# EAGLE design TinyGame RC2 (EAGLE 7.7.0)
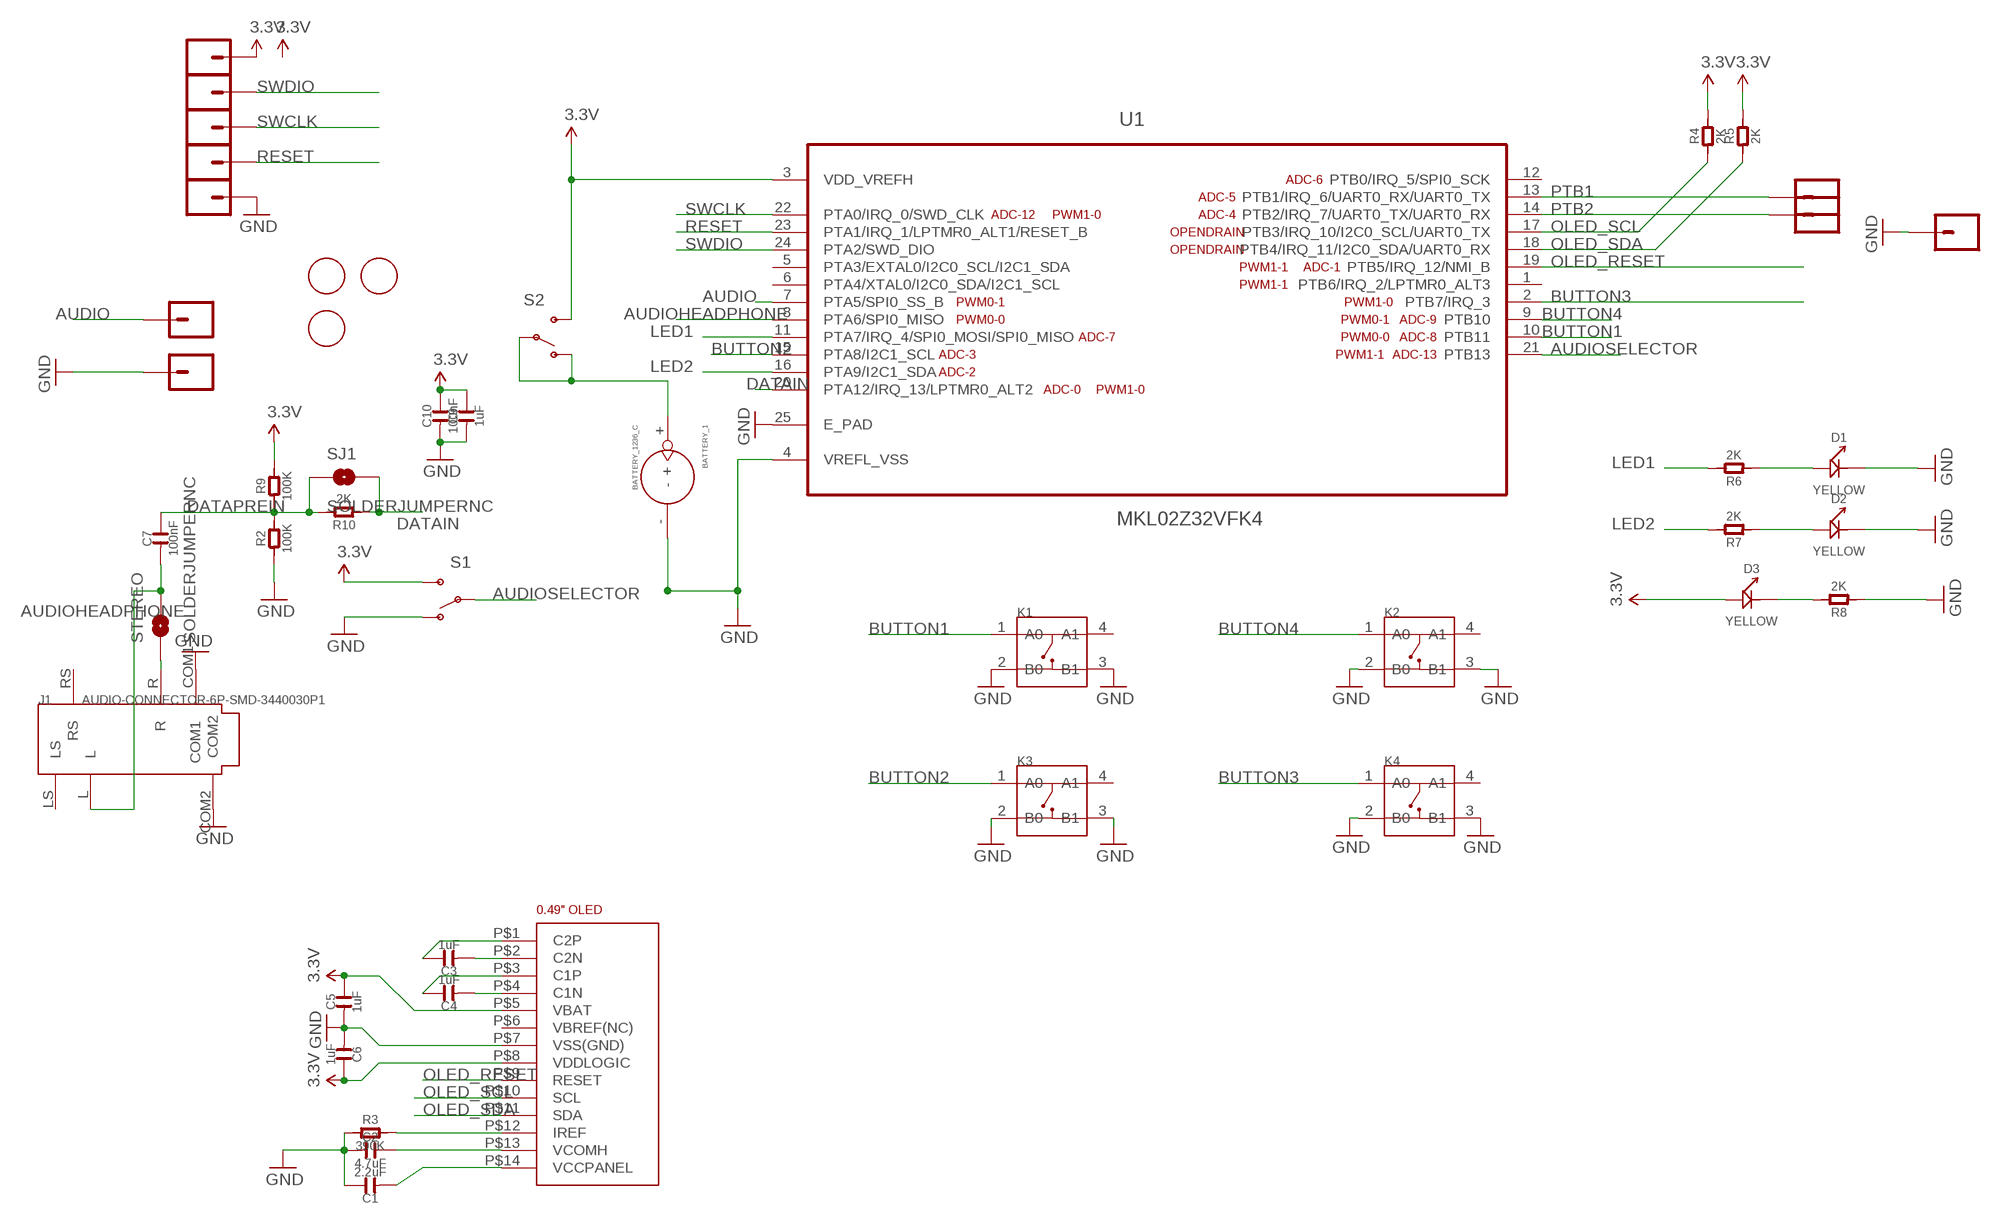
[diagram p0: schematic, sheet 1]

## Parts
AUDIOGND  M01SMD-4.5X1.5  [PAD-1.5X4.5]
AUDIOSIG  M01SMD-4.5X1.5  [PAD-1.5X4.5]
BATTERY_1  BATTERY_1236_C  [BATTERY_1236_C]
C1  2.2uF  C-0603  [C0603]
C2  4.7uF  C-0603  [C0603]
C3  1uF  C-0603  [C0603]
C4  1uF  C-0603  [C0603]
C5  1uF  C-0603  [C0603]
C6  1uF  C-0603  [C0603]
C7  100nF  C-0603  [C0603]
C9  1uF  C-0603  [C0603]
C10  100nF  C-0603  [C0603]
D1  YELLOW  LED  [LED0603]
D2  YELLOW  LED  [LED0603]
D3  YELLOW  LED  [LED0603]
J1  AUDIO-CONNECTOR-6P-SMD-3440030P1  [6P-SMD-3.5]
K1  BUTTON-4P-3100010P1  [4P-SMD-6.0X6.0X5.0H]
K2  BUTTON-4P-3100010P1  [4P-SMD-6.0X6.0X5.0H]
K3  BUTTON-4P-3100010P1  [4P-SMD-6.0X6.0X5.0H]
K4  BUTTON-4P-3100010P1  [4P-SMD-6.0X6.0X5.0H]
PTA6_MISO1  M01SMD-4.5X1.5  [PAD-1.5X4.5]
PTA6_MISO2  M01SMD-4.5X1.5  [PAD-1.5X4.5]
PTA6_MISO3  M01SMD-4.5X1.5  [PAD-1.5X4.5]
PTA6_MISO4  M01SMD-4.5X1.5  [PAD-1.5X4.5]
PTA6_MISO5  M01SMD-4.5X1.5  [PAD-1.5X4.5]
PTB1_RXTX  M01SMD-4.5X1.5  [PAD-1.5X4.5]
PTB2_TXRX  M01SMD-4.5X1.5  [PAD-1.5X4.5]
PTB2_TXRX2  M01SMD-4.5X1.5  [PAD-1.5X4.5]
R2  100K  R-0603  [R0603]
R3  390K  R-0603  [R0603]
R4  2K  R-0603  [R0603]
R5  2K  R-0603  [R0603]
R6  2K  R-0603  [R0603]
R7  2K  R-0603  [R0603]
R8  2K  R-0603  [R0603]
R9  100K  R-0603  [R0603]
R10  2K  R-0603  [R0603]
S1  SWITCH-SPDT-SMD-A  [SWITCH-SPST-SMD-A]
S2  SWITCH-SPDT-SMD-A  [SWITCH-SPST-SMD-A]
SJ1  SOLDERJUMPERNC  [SJ_2S]
STEREO  SOLDERJUMPERNC  [SJ_2S]
U1  MKL02Z32VFK4  [QFN50P400X400X100-25N]
U$1  0.49"OLEDFOLDED  [0.49"-FPC-0.7-14-FOLDED]
U$2  FIDUCIAL  [FIDUCIAL_1MM]
U$3  FIDUCIAL  [FIDUCIAL_1MM]
U$4  FIDUCIAL  [FIDUCIAL_1MM]

## Nets
3.3V: C5.2 C6.2 C9.2 C10.2 D3.+ PTA6_MISO1.P$1 R4.2 R5.2 R9.2 S1.3(S) S2.3(S) U1.3(VDD_VREFH) U$1.P$5(VBAT) U$1.P$8(VDDLOGIC)
AUDIO: AUDIOSIG.P$1 U1.7(PTA5/SPI0_SS_B)
AUDIOHEADPHONE: C7.1 J1.L STEREO.2 U1.8(PTA6/SPI0_MISO)
AUDIOSELECTOR: S1.2(P) U1.21(PTB13)
BUTTON1: K1.1(A0) U1.10(PTB11)
BUTTON2: K3.1(A0) U1.15(PTA8/I2C1_SCL)
BUTTON3: K4.1(A0) U1.2(PTB7/IRQ_3)
BUTTON4: K2.1(A0) U1.9(PTB10)
DATAIN: R10.1 SJ1.2 U1.20(PTA12/IRQ_13/LPTMR0_ALT2)
DATAPREIN: C7.2 R2.2 R9.1 R10.2 SJ1.1
GND [GND]: AUDIOGND.P$1 BATTERY_1.- C1.2 C2.1 C5.1 C6.1 C9.1 C10.1 D1.- D2.- J1.COM1 J1.COM2 K1.2(B0) K1.3(B1) K2.2(B0) K2.3(B1) K3.2(B0) K3.3(B1) K4.2(B0) K4.3(B1) PTA6_MISO5.P$1 PTB2_TXRX2.P$1 R2.1 R3.1 R8.1 S1.1(O) U1.4(VREFL_VSS) U1.25(E_PAD) U$1.P$7(VSS(GND))
LED1: R6.2 U1.11(PTA7/IRQ_4/SPI0_MOSI/SPI0_MISO)
LED2: R7.2 U1.16(PTA9/I2C1_SDA)
N$1: J1.R STEREO.1
N$3: C3.2 U$1.P$1(C2P)
N$4: C4.2 U$1.P$3(C1P)
N$6: D1.+ R6.1
N$9: R3.2 U$1.P$12(IREF)
N$10: C1.1 U$1.P$14(VCCPANEL)
N$11: C2.2 U$1.P$13(VCOMH)
N$12: C3.1 U$1.P$2(C2N)
N$13: C4.1 U$1.P$4(C1N)
N$14: D2.+ R7.1
N$19: D3.- R8.2
OLED_RESET: U1.19(PTB5/IRQ_12/NMI_B) U$1.P$9(RESET)
OLED_SCL: R4.1 U1.17(PTB3/IRQ_10/I2C0_SCL/UART0_TX) U$1.P$10(SCL)
OLED_SDA: R5.1 U1.18(PTB4/IRQ_11/I2C0_SDA/UART0_RX) U$1.P$11(SDA)
PTB1: PTB1_RXTX.P$1 U1.13(PTB1/IRQ_6/UART0_RX/UART0_TX)
PTB2: PTB2_TXRX.P$1 U1.14(PTB2/IRQ_7/UART0_TX/UART0_RX)
RESET: PTA6_MISO4.P$1 U1.23(PTA1/IRQ_1/LPTMR0_ALT1/RESET_B)
SWCLK: PTA6_MISO3.P$1 U1.22(PTA0/IRQ_0/SWD_CLK)
SWDIO: PTA6_MISO2.P$1 U1.24(PTA2/SWD_DIO)
VBAT: BATTERY_1.+ S2.1(O) S2.2(P)
Unconnected: J1.LS J1.RS K1.4(A1) K2.4(A1) K3.4(A1) K4.4(A1) U1.1(PTB6/IRQ_2/LPTMR0_ALT3) U1.5(PTA3/EXTAL0/I2C0_SCL/I2C1_SDA) U1.6(PTA4/XTAL0/I2C0_SDA/I2C1_SCL) U1.12(PTB0/IRQ_5/SPI0_SCK) U$1.P$6(VBREF(NC))

## Library data of the parts
AUDIOGND AUDIOSIG PTA6_MISO1-PTA6_MISO5 PTB1_RXTX PTB2_TXRX PTB2_TXRX2 = SparkFun-Connectors:M01: Header 1 Standard 1-pin 0.1" header. Use with straight break away headers (SKU : PRT-00116), right angle break away headers (PRT-00553), swiss pins (PRT-00743), machine pins (PRT-00117), and female headers (PRT-00115).
BATTERY_1 = MicroGameboyParts:BATTERY_1236_C: SOC004
C1-C7 C9 C10 = OPL:C*
D1-D3 = OPL:LED*: LED
J1 = OPL:AUDIO-CONNECTOR-6P-SMD
K1-K4 = zephod-components:BUTTON-4P
R2-R10 = OPL:R*
S1 S2 = SparkFun-Electromechanical:SWITCH-SPDT: SPDT Switch Simple slide switch, Spark Fun Electronics SKU : COM-00102 DPDT SMT slide switch, AYZ0202, SWCH-08179
SJ1 STEREO = SparkFun-Passives:SOLDERJUMPER: Solder Jumper Standard SMD solder jumper. Used to automate production. Two varients : Normally Open and Normally Closed are the same, but have different paste layers. NC will have a large amount of paste and should jumper during reflow.
U1 = FarnellThings:MKL02Z32VFK4: IC, MCU, 32BIT, CORTEX M0+, 48MHZ, QFN-24; MPN: MKL02Z32VFK4; OC_FARNELL: 2321481; OC_NEWARK: 61W9887; PACKAGE: QFN-24; SUPPLIER: FREESCALE SEMICONDUCTOR
U$1 = zephod-tft:0.49"OLED
U$2-U$4 = adafruit:FIDUCIAL: For use by pick and place machines to calibrate the vision/machine, 1mm By microbuilder.eu

## Net classes
0 default: clearance 0.178 mm
1 GND: width 0.203 mm, drill 0.203 mm, clearance 0.203 mm

## Board
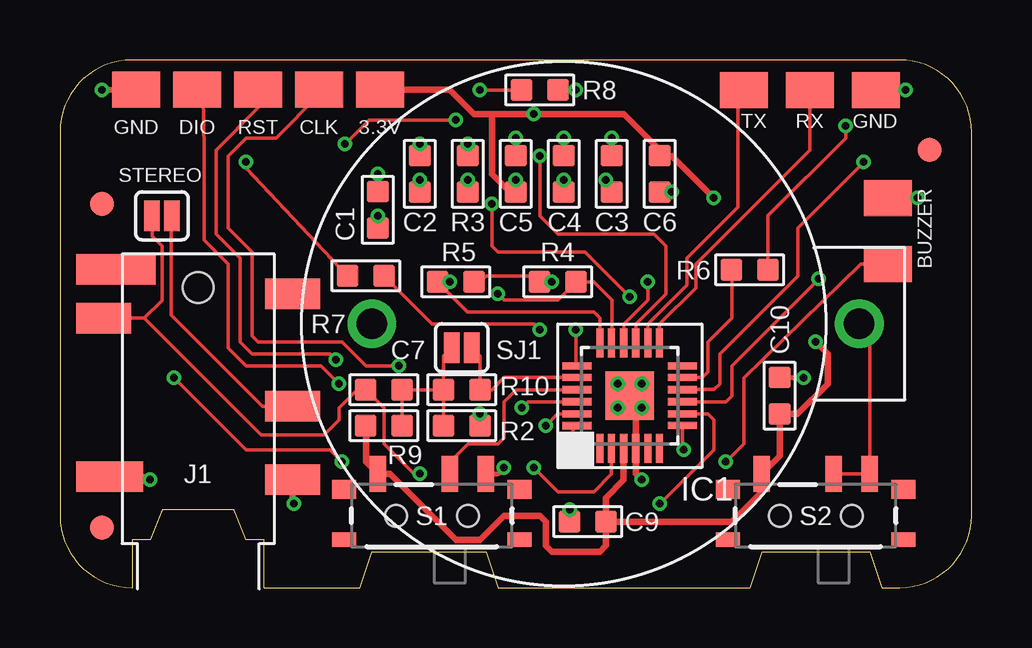
[diagram p1: board, top side]
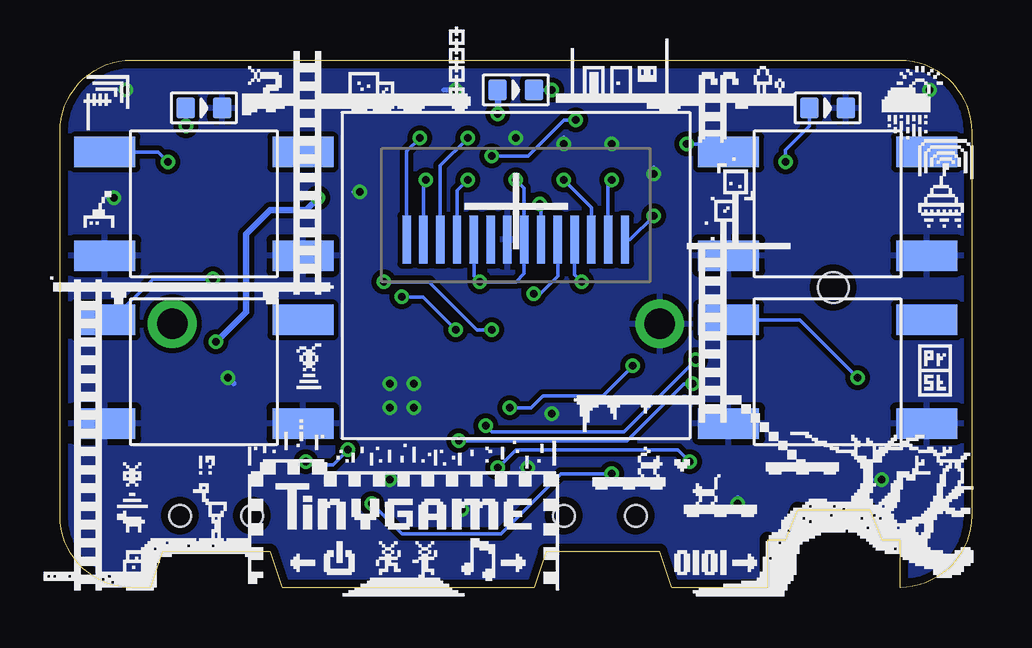
[diagram p2: board, bottom side, seen from below]

Size 38 x 22 mm. Coordinates in mm from the lower left corner, seen from the top.
Outline: 38,3 38,19 arc90 35,22 3,22 arc90 0,19 0,3 arc90 3,0 3,2 3.75,2 4.25,3.25 7.25,3.25 7.75,2 8.5,2 8.5,0 12.5,0 13,1.5 17.75,1.5 18.25,0 28.75,0 29.25,1.5 33.75,1.5 34.25,0 35,0 arc90 38,3
Copper layers (1*16): Top 0.035mm / dielectric 1.5mm / Bottom 0.035mm
Design rules "ITEADstudio_DRC *": minimum track width 6mil, minimum drill 12mil, track to track 6mil, track to pad 6mil, pad to pad 6mil, via to via 6mil, smd to smd 0mil, copper to edge 13mil, drill to drill 10mil, minimum pad ring 10mil, minimum via ring 6mil, stop-mask expansion 2mil, vias tented up to drill 100mil, thermal gap 10mil

### Footprints (pad centres in the part's own frame; a part is rotated, then mirrored left to right if it is on the bottom)
PAD-1.5X4.5 = smd 1.5 x 2: P$1 0,0
BATTERY_1236_C = drill 1.27 pad 2.032: + 0,-12.319; - 0,8.001
C0603 = smd 0.889 x 0.889: 1 -0.762,0; 2 0.762,0
LED0603 = smd 0.762 x 0.889: + -0.762,0; - 0.762,0
6P-SMD-3.5 = smd 1.27 x 2.286: COM1 2.413,3.937; L -4.318,-3.937; R -0.635,3.937; RS -5.334,3.937 | smd 1.27 x 2.794: COM2 2.286,-3.683 | smd 1.27 x 3.302: LS -6.35,-3.429 | hole 1.27: -5.588,0
4P-SMD-6.0X6.0X5.0H = smd 2.54 x 1.27: 1 -4.129,2.159; 2 -4.129,-2.159; 3 4.129,-2.159; 4 4.129,2.159
R0603 = smd 0.889 x 0.889: 1 -0.762,0; 2 0.762,0
SWITCH-SPST-SMD-A = smd 0.7 x 1.5: 1 -2.25,-1.75; 2 -0.75,-1.75; 3 2.25,-1.75 | smd 1 x 0.6: GND1 -3.65,1; GND3 3.65,1 | smd 1 x 0.8: GND2 -3.65,-1.1; GND4 3.65,-1.1 | hole 0.9: -1.5,0; 1.5,0
SJ_2S = smd 0.635 x 1.27: 1 -0.412,0; 2 0.412,0
QFN50P400X400X100-25N = smd 1.2 x 0.3: 1 -2.2,1.245; 2 -2.2,0.762; 3 -2.2,0.254; 4 -2.2,-0.254; 5 -2.2,-0.762; 6 -2.2,-1.245; 13 2.2,-1.245; 14 2.2,-0.762; 15 2.2,-0.254; 16 2.2,0.254; 17 2.2,0.762; 18 2.2,1.245 | smd 0.3 x 1.2: 7 -1.245,-2.2; 8 -0.762,-2.2; 9 -0.254,-2.2; 10 0.254,-2.2; 11 0.762,-2.2; 12 1.245,-2.2; 19 1.245,2.2; 20 0.762,2.2; 21 0.254,2.2; 22 -0.254,2.2 | smd 0.305 x 1.2: 23 -0.762,2.2; 24 -1.245,2.2 | smd 2.032 x 2.032: 25 0,0
0.49"-FPC-0.7-14-FOLDED = smd 0.35 x 2: P$1 -4.55,-1.49; P$2 -3.85,-1.49; P$3 -3.15,-1.49; P$4 -2.45,-1.49; P$5 -1.75,-1.49; P$6 -1.05,-1.49; P$7 -0.35,-1.49; P$8 0.35,-1.49; P$9 1.05,-1.49; P$10 1.75,-1.49; P$11 2.45,-1.49; P$12 3.15,-1.49; P$13 3.85,-1.49; P$14 4.55,-1.49
FIDUCIAL_1MM = smd 1 x 1: 1 0,0

### Placement (x,y rotation side)
AUDIOGND  34.5,16.25 90 top
AUDIOSIG  34.5,13.5 90 top
BATTERY_1  21,11 90 top
C1  13.25,15.75 90 top
C2  15,17.25 270 top
C3  23,17.25 90 top
C4  21,17.25 90 top
C5  19,17.25 270 top
C6  25,17.25 90 top
C7  13.5,8.25 0 top
C9  22,2.75 0 top
C10  30,8 270 top
D1  32,20 0 bottom
D2  6,20 0 bottom
D3  19,20.75 0 bottom
J1  5.76,6.92 270 top
K1  32,16 0 bottom
K2  32,9 0 bottom
K3  6,16 0 bottom
K4  6,9 0 bottom
PTA6_MISO1  13.34,20.77 90 top
PTA6_MISO2  5.71,20.77 90 top
PTA6_MISO3  10.79,20.77 90 top
PTA6_MISO4  8.26,20.77 90 top
PTA6_MISO5  3.17,20.77 90 top
PTB1_RXTX  31.25,20.75 270 top
PTB2_TXRX  28.5,20.75 270 top
PTB2_TXRX2  34,20.75 270 top
R2  16.75,6.75 180 top
R3  17,17.25 270 top
R4  20.75,12.75 180 top
R5  16.5,12.75 0 top
R6  28.75,13.25 180 top
R7  12.75,13 0 top
R8  20,20.75 180 top
R9  13.5,6.75 180 top
R10  16.75,8.25 180 top
S1  15.5,3 180 top
S2  31.5,3 180 top
SJ1  16.75,10 0 top
STEREO  4.25,15.5 180 top
U1  23.75,8 90 top
U$1  19,16 0 bottom
U$2  1.75,16 0 top
U$3  1.75,2.5 0 top
U$4  36.25,18.25 0 top
U$5  TINYGAMEARTPOS  [TINYGAMEART]  38.73,-0.2 0 bottom

### Tracks (layer width: path | path; a pad name or v marks a point on that pad's centre or on a via)
3.3V  (via drill 0.3)
  Top 0.152: 22.75,3.01 C9.2 | 12.75,6.74 R9.2 | C5.2 18.76,16.49 | v19,17 C5.2 | 25,18.25 C6.2 25.01,18 | v20.5,12.75 R4.2 19.74,13 17.75,13 17.5,12.75 R5.2 17.25,12.76 | 18.65,16.14 C5.2
  Top 0.279: U1.3 23.5,4.5 22.75,3.75 22.75,3.01 | PTA6_MISO1.P$1 16.23,20.77 17.25,19.75 18,19.75 | 18,19.75 v19.75,19.75 23.5,19.75 25,18.25 | 18.76,16.49 18,17.25 18,19.75 | v31.5,10.25 32,9.75 32,8.5 30.74,7.24 C10.2 30,5.5 S2.3 29.25,4 28,2.75 C9.2 22.76,1.76 22.5,1.5 20.5,1.5 20.25,1.75 20.25,2.75 20,3 18.5,3 17.5,2 16.5,2 13.75,4.75 S1.3 12.75,5.25 12.75,6.74 | v27.25,16.25 25.5,18 25.01,18
  Bottom 0.152: v19,17 18.65,16.65 U$1.P$8 18.65,13.1 19,12.75 v20.5,12.75 20.75,13 U$1.P$5
  Bottom 0.279: v19.75,19.75 19.75,19.99 D3.+ | v31.5,10.25 30.25,11.5 30.25,14.75 29.25,15.75 27.75,15.75 v27.25,16.25
AUDIO  (via drill 0.3)
  Top 0.152: AUDIOSIG.P$1 33.38,13.5 28.5,8.75 28.5,6 v27.75,5.25 | U1.7 25.95,5.8 v26,5.75
  Bottom 0.152: v26,5.75 26.62,5.12 27.62,5.12 v27.75,5.25
AUDIOHEADPHONE  (via drill 0.3)
  Top 0.152: J1.L 3.51,11.24 | U1.8 27.01,7.24 27.25,7 27.25,5.75 v25,3.5 | v15,4.75 14.75,4.75 13.5,6 13.5,7.49 C7.1 12.38,8.25 11.62,7.5 11.62,7 11,6.38 8.38,6.38 3.51,11.24 | STEREO.2 3.84,14.66 4.25,14.25 4.25,11.98 3.51,11.24
  Bottom 0.152: v25,3.5 23.75,2.25 19.62,2.25 17.12,4.75 v15,4.75
AUDIOSELECTOR
  Top 0.152: S1.2 16.25,5.25 17,6 18.25,6 18.5,6.25 18.5,7.75 19,8.25 U1.21
BUTTON1  (via drill 0.3)
  Top 0.152: U1.10 27.25,8.25 27.5,8.5 27.5,9.75 30.75,13 30.75,15 v33.5,17.75
  Bottom 0.152: K1.1 33.91,18.16 v33.5,17.75
BUTTON2  (via drill 0.3)
  Top 0.152: U1.15 24,11 25.25,12.25 25.25,14.25 24.75,14.75 20.75,14.75 20,15.5 v20,18 | v16.5,19.5 12.88,19.5 v11.88,18.5
  Bottom 0.152: v20,18 18.5,18 17,19.5 v16.5,19.5 | v11.88,18.5 10.47,18.5 K3.1
BUTTON3  (via drill 0.3)
  Top 0.152: U1.2 22.99,4.74 22.25,4 20.75,4 v19.75,5 | v11.75,5.25 11.25,5.75 7.75,5.75 v4.75,8.75
  Bottom 0.152: v19.75,5 19,5.75 12.25,5.75 v11.75,5.25 | v4.75,8.75 7.16,11.16 K4.1
BUTTON4  (via drill 0.3)
  Top 0.152: v31.62,12.88 28,9.25 28,8 27.75,7.75 U1.9
  Bottom 0.152: K2.1 35.84,11.16 34.12,12.88 v31.62,12.88
DATAIN
  Top 0.152: SJ1.2 17.51,9.65 R10.1 18,8.25 18.51,8.76 U1.20 21.54,8.75
DATAPREIN
  Top 0.152: R9.1 C7.2 R10.2 | R10.2 15.99,9.65 SJ1.1 | R10.2 R2.2
GND  (via drill 0.3)
  Top 0.203: 24,8 U1.25 | C6.1 25.49,16.49 v25.5,16.5 | PTA6_MISO5.P$1 2.89,20.77 | PTB2_TXRX2.P$1 v35.25,20.75 | AUDIOGND.P$1 v35.75,16.25 | R8.1 v21.5,20.75 | J1.COM2 3.62,4.63 v3.75,4.5 | S1.1 18.25,4.75 v18.5,5 | R2.1 v17.5,7.25 | C1.2 v13.25,17.25 | C2.1 v15,18.5 | R3.1 v17,18.5 | C5.1 v19,18.75 | C10.1 30.74,8.76 v31,8.75 | C9.1 21.24,2.99 v21.25,3.25
  Top 0.279: 24,8 U1.4 24,4.75 v24.25,4.5 | 2.89,20.77 v1.75,20.75 | J1.COM1 9.7,3.7 v9.75,3.5
  Bottom 0.203: v25.5,16.5 25.75,16.5 | v1.75,20.75 1.75,20.5 | v35.25,20.75 35.5,20.75 | v35.75,16.25 36,16.25 | v21.5,20.75 22,20.75 | v3.75,4.5 4,4.5 | v18.5,5 18.75,5 | v13.25,17.25 13.25,17.5 | v17,18.5 17,18.75 | v31,8.75 30.75,8.5 | v9.75,3.5 9.75,3.75
  other vias: 23.25,8.5 24.25,8.5 24.25,7.5 23.25,7.5
  pour Bottom: 0,3 0,19 arc-90 3,22 35,22 arc-90 38,19 38,3 arc-90 35,0 3,0 arc-90
LED1
  Top 0.152: U1.11 26.74,8.76 26.75,8.75 27,9 27,10.25 28,11.25 28,13.24 R6.2
LED2  (via drill 0.3)
  Top 0.152: R7.2 13.51,12.99 15.5,11 19.75,11 v20,10.75 | v24.5,12.75 24.5,12 23.5,11 U1.16
  Bottom 0.152: v20,10.75 20.62,10.75 22.62,12.75 v24.5,12.75
N$1
  Top 0.152: STEREO.1 4.62,15.41 4.62,11.38 8.45,7.55 J1.R
N$3  (via drill 0.3)
  Top 0.152: v23,18.75 C3.2
  Bottom 0.152: U$1.P$1 23.55,18.2 v23,18.75
N$4  (via drill 0.3)
  Top 0.152: v21,18.75 C4.2
  Bottom 0.152: U$1.P$3 22.15,17.6 v21,18.75
N$6  (via drill 0.3)
  Top 0.152: R6.1 29.51,15.51 32.75,18.75 v32.75,19.25
  Bottom 0.152: v32.75,19.25 32.75,19.99 D1.+
N$9  (via drill 0.3)
  Top 0.152: v17,17 R3.2
  Bottom 0.152: U$1.P$12 15.85,15.85 v17,17
N$10  (via drill 0.3)
  Top 0.152: v13.25,15.5 C1.1
  Bottom 0.152: U$1.P$14 14.24,14.51 v13.25,15.5
N$11  (via drill 0.3)
  Top 0.152: v15,17 C2.2
  Bottom 0.152: U$1.P$13 15.15,16.85 v15,17
N$12  (via drill 0.3)
  Top 0.152: v22.75,17 C3.1
  Bottom 0.152: U$1.P$2 22.85,16.85 v22.75,17
N$13  (via drill 0.3)
  Top 0.152: v21,17 C4.1
  Bottom 0.152: U$1.P$4 21.45,16.55 v21,17
N$14  (via drill 0.3)
  Top 0.152: v7.75,17.75 7.75,17.49 R7.1
  Bottom 0.152: v7.75,17.75 7.76,18.24 6.76,19.24 D2.+
N$19  (via drill 0.3)
  Top 0.152: R8.2 v17.5,20.75
  Bottom 0.152: v17.5,20.75 D3.-
OLED_RESET  (via drill 0.3)
  Top 0.152: v18,16 18,14.25 18.25,14 21.88,14 v23.75,12.12 | v21.5,10.75 21.5,9.29 U1.19
  Bottom 0.152: U$1.P$9 17.95,15.95 v18,16 | v23.75,12.12 22.88,12.12 v21.5,10.75
OLED_SCL  (via drill 0.3)
  Top 0.152: U1.17 23,10.21 23,12 22.25,12.75 R4.1 20.75,12 18.5,12 v18.25,12.25
  Bottom 0.152: v18.25,12.25 18,12.25 17.25,13 U$1.P$10
OLED_SDA  (via drill 0.3)
  Top 0.152: U1.18 22.5,11.25 22.25,11.5 16.99,11.5 R5.1 v16.25,12.75
  Bottom 0.152: U$1.P$11 16.55,13.05 v16.25,12.75
PTB1
  Top 0.152: PTB1_RXTX.P$1 31.25,18.25 26.5,13.5 26.5,12.5 25,10.99 U1.13
PTB2
  Top 0.152: PTB2_TXRX.P$1 28.25,20.5 28.25,15.88 26.12,13.75 26.12,12.62 24.5,11 24.51,10.99 U1.14
RESET  (via drill 0.3)
  Top 0.152: PTA6_MISO4.P$1 8.26,20 6.5,18.25 6.5,14.75 7.5,13.75 7.5,10.25 8,9.75 11.25,9.75 v11.5,9.5 | U1.23 20.74,7.24 v20.25,6.75
  Bottom 0.152: v20.25,6.75 20,6.5 14.5,6.5 v11.5,9.5
SWCLK  (via drill 0.3)
  Top 0.152: PTA6_MISO3.P$1 10.79,20.55 9,18.75 7.75,18.75 7,18 7,15 8,14 8,10.5 8.25,10.25 11.75,10.25 12.75,9.25 v14.12,9.25 | U1.22 19.5,7.75 v19.25,7.5
  Bottom 0.152: v19.25,7.5 18.38,7.5 17.88,8 15.38,8 v14.12,9.25
SWDIO  (via drill 0.3)
  Top 0.152: PTA6_MISO2.P$1 5.96,20.54 6,18.25 6,14.5 7,13.5 7,10 7.75,9.25 10.88,9.25 v11.62,8.5 | U1.24 21.38,6.75 v21.38,6.12
  Bottom 0.152: v21.38,6.12 14.38,6.12 12,8.5 v11.62,8.5
VBAT
  Top 0.152: S2.2 S2.1 33.75,10.57 BATTERY_1.+

### Text on the board
tPlace: TX | RX | GND | GND | DIO | RST | CLK | 3.3V | BUZZER
tNames: IC1